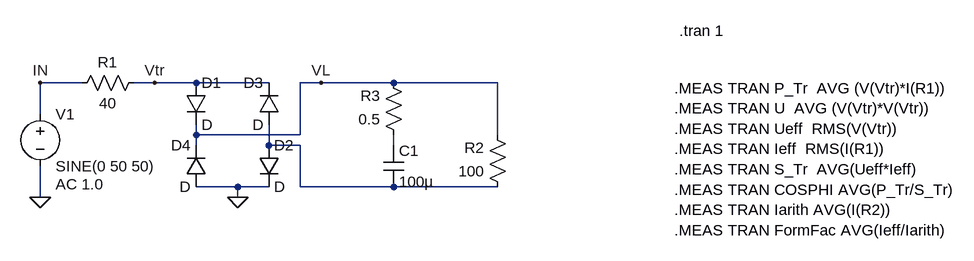
[diagram p0: schematic BrueckeGr.asc]
BrueckeGr.asc, the LTspice schematic file:
Version 4
SHEET 1 1124 680
WIRE -304 240 -368 240
WIRE -192 240 -224 240
WIRE -128 240 -192 240
WIRE -16 240 -128 240
WIRE 64 240 32 240
WIRE 176 240 64 240
WIRE 336 240 176 240
WIRE -368 288 -368 240
WIRE -128 320 -128 304
WIRE 32 320 32 240
WIRE 32 320 -128 320
WIRE 336 320 336 240
WIRE -128 336 -128 320
WIRE -16 336 -16 304
WIRE 32 336 -16 336
WIRE 176 336 176 320
WIRE -64 400 -128 400
WIRE -16 400 -64 400
WIRE 32 400 32 336
WIRE 176 400 32 400
WIRE 336 400 176 400
WIRE -368 416 -368 368
WIRE -64 416 -64 400
FLAG -368 416 0
FLAG -368 240 IN
FLAG -192 240 Vtr
FLAG 64 240 VL
FLAG -64 416 0
SYMBOL voltage -368 272 R0
WINDOW 123 24 124 Left 2
WINDOW 39 0 0 Left 2
SYMATTR Value2 AC 1.0
SYMATTR InstName V1
SYMATTR Value SINE(0 50 50)
SYMBOL res -208 224 R90
WINDOW 0 0 56 VBottom 2
WINDOW 3 32 56 VTop 2
SYMATTR InstName R1
SYMATTR Value 40
SYMBOL diode -144 240 R0
SYMATTR InstName D1
SYMBOL res 352 416 R180
WINDOW 0 36 76 Left 2
WINDOW 3 36 40 Left 2
SYMATTR InstName R2
SYMATTR Value 100
SYMBOL diode -32 336 R0
SYMATTR InstName D2
SYMBOL diode 0 304 R180
WINDOW 0 24 64 Left 2
WINDOW 3 24 0 Left 2
SYMATTR InstName D3
SYMBOL diode -112 400 R180
WINDOW 0 24 64 Left 2
WINDOW 3 24 0 Left 2
SYMATTR InstName D4
SYMBOL cap 160 336 R0
SYMATTR InstName C1
SYMATTR Value 100µ
SYMBOL res 192 336 R180
WINDOW 0 36 76 Left 2
WINDOW 3 36 40 Left 2
SYMATTR InstName R3
SYMATTR Value 0.5
TEXT 608 248 Left 2 !.MEAS TRAN P_Tr  AVG (V(Vtr)*I(R1))\n.MEAS TRAN U  AVG (V(Vtr)*V(Vtr))\n.MEAS TRAN Ueff  RMS(V(Vtr))\n.MEAS TRAN Ieff  RMS(I(R1))\n.MEAS TRAN S_Tr  AVG(Ueff*Ieff)\n.MEAS TRAN COSPHI AVG(P_Tr/S_Tr)\n.MEAS TRAN Iarith AVG(I(R2))\n.MEAS TRAN FormFac AVG(Ieff/Iarith)
TEXT 616 160 Left 2 !.tran 1

The netlist it stands for:
* BrueckeGr.asc
V1 IN 0 SINE(0 50 50) AC 1.0
R1 Vtr IN 40
D1 Vtr VL D
R2 N001 VL 100
D2 N001 0 D
D3 N001 Vtr D
D4 0 VL D
C1 N002 N001 100µ
R3 N002 VL 0.5
.model D D
.lib standard.dio
.MEAS TRAN P_Tr  AVG (V(Vtr)*I(R1))
.MEAS TRAN U  AVG (V(Vtr)*V(Vtr))
.MEAS TRAN Ueff  RMS(V(Vtr))
.MEAS TRAN Ieff  RMS(I(R1))
.MEAS TRAN S_Tr  AVG(Ueff*Ieff)
.MEAS TRAN COSPHI AVG(P_Tr/S_Tr)
.MEAS TRAN Iarith AVG(I(R2))
.MEAS TRAN FormFac AVG(Ieff/Iarith)
.tran 1
.backanno
.end